# Altium schematic sheet [08] - FPGA - DDR3.SchDoc
size A2; DocumentNumber: 8; SheetNumber: 8; SheetTotal: 15
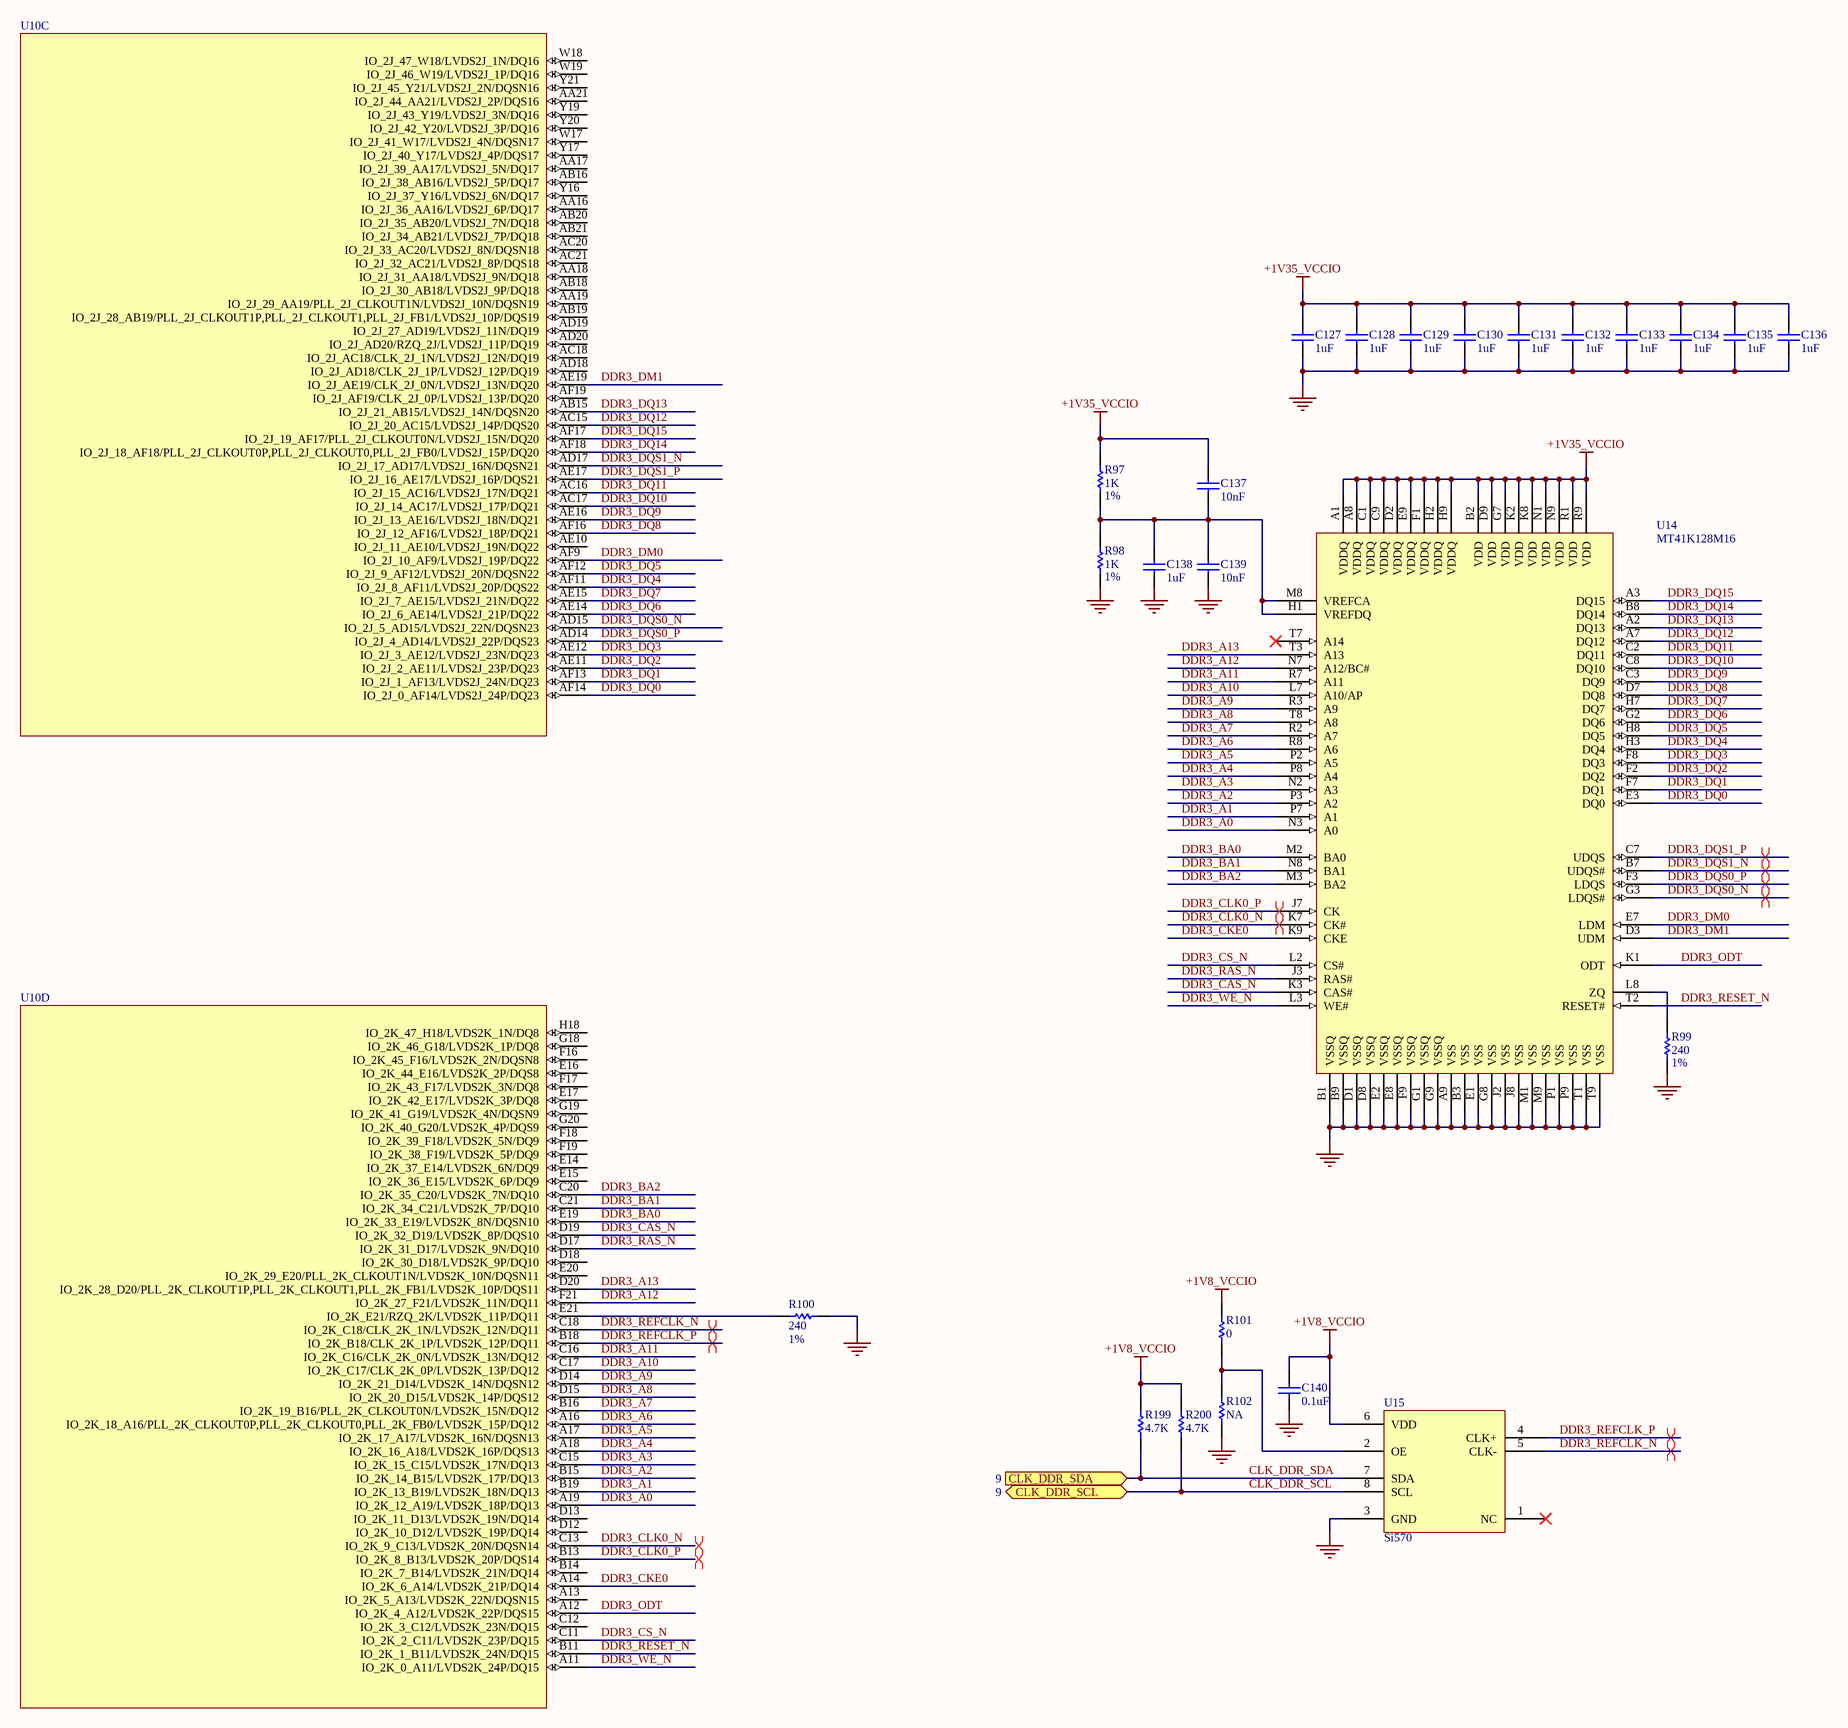
[diagram p0: [08] - FPGA - DDR3.SchDoc]

## Parts
C127  1uF  [0402_C]
C128  1uF  [0402_C]
C129  1uF  [0402_C]
C130  1uF  [0402_C]
C131  1uF  [0402_C]
C132  1uF  [0402_C]
C133  1uF  [0402_C]
C134  1uF  [0402_C]
C135  1uF  [0402_C]
C136  1uF  [0402_C]
C137  10nF  [0402_C]
C138  1uF  [0805_C]
C139  10nF  [0402_C]
C140  0.1uF  [0402_C]
R97  1K  Tolerance: 1%  [0402_R]
R98  1K  Tolerance: 1%  [0402_R]
R99  240  Tolerance: 1%  [0402_R]
R100  240  Tolerance: 1%  [0402_R]
R101  0  [0402_R]
R102  NA  [0402_R]
R199  4.7K  [0402_R]
R200  4.7K  [0402_R]
U10  10AX016 F27  [FBGA672]  (value not drawn)  (parts C,D of 12)
U14  MT41K128M16  [FBGA96]
U15  Si570

## Ports
CLK_DDR_SCL (bidir, see 9), CLK_DDR_SDA (in, see 9)

## Nets
+1V8_VCCIO: C140.1 R101.2 R199.2 R200.2 U15.6(VDD)
+1V35_VCCIO: C127.2 C128.2 C129.2 C130.2 C131.2 C132.2 C133.2 C134.2 C135.2 C136.2 C137.2 R97.2 U14.A1(VDDQ) U14.A8(VDDQ) U14.B2(VDD) U14.C1(VDDQ) U14.C9(VDDQ) U14.D2(VDDQ) U14.D9(VDD) U14.E9(VDDQ) U14.F1(VDDQ) U14.G7(VDD) U14.H2(VDDQ) U14.H9(VDDQ) U14.K2(VDD) U14.K8(VDD) U14.N1(VDD) U14.N9(VDD) U14.R1(VDD) U14.R9(VDD)
GND: C127.1 C128.1 C129.1 C130.1 C131.1 C132.1 C133.1 C134.1 C135.1 C136.1 C138.1 C139.1 C140.2 R98.1 R99.1 R100.1 R102.1 U14.A9(VSS) U14.B1(VSSQ) U14.B3(VSS) U14.B9(VSSQ) U14.D1(VSSQ) U14.D8(VSSQ) U14.E1(VSS) U14.E2(VSSQ) U14.E8(VSSQ) U14.F9(VSSQ) U14.G1(VSSQ) U14.G8(VSS) U14.G9(VSSQ) U14.J2(VSS) U14.J8(VSS) U14.M1(VSS) U14.M9(VSS) U14.P1(VSS) U14.P9(VSS) U14.T1(VSS) U14.T9(VSS) U15.3(GND)
CLK_DDR_SCL: R200.1 U15.8(SCL) ; port CLK_DDR_SCL
CLK_DDR_SDA: R199.1 U15.7(SDA) ; port CLK_DDR_SDA
DDR3_A0: U10.A19(IO_2K_12_A19/LVDS2K_18P/DQ13) U14.N3(A0)
DDR3_A1: U10.B19(IO_2K_13_B19/LVDS2K_18N/DQ13) U14.P7(A1)
DDR3_A2: U10.B15(IO_2K_14_B15/LVDS2K_17P/DQ13) U14.P3(A2)
DDR3_A3: U10.C15(IO_2K_15_C15/LVDS2K_17N/DQ13) U14.N2(A3)
DDR3_A4: U10.A18(IO_2K_16_A18/LVDS2K_16P/DQS13) U14.P8(A4)
DDR3_A5: U10.A17(IO_2K_17_A17/LVDS2K_16N/DQSN13) U14.P2(A5)
DDR3_A6: U10.A16(IO_2K_18_A16/PLL_2K_CLKOUT0P,PLL_2K_CLKOUT0,PLL_2K_FB0/LVDS2K_15P/DQ12) U14.R8(A6)
DDR3_A7: U10.B16(IO_2K_19_B16/PLL_2K_CLKOUT0N/LVDS2K_15N/DQ12) U14.R2(A7)
DDR3_A8: U10.D15(IO_2K_20_D15/LVDS2K_14P/DQS12) U14.T8(A8)
DDR3_A9: U10.D14(IO_2K_21_D14/LVDS2K_14N/DQSN12) U14.R3(A9)
DDR3_A10: U10.C17(IO_2K_C17/CLK_2K_0P/LVDS2K_13P/DQ12) U14.L7(A10/AP)
DDR3_A11: U10.C16(IO_2K_C16/CLK_2K_0N/LVDS2K_13N/DQ12) U14.R7(A11)
DDR3_A12: U10.F21(IO_2K_27_F21/LVDS2K_11N/DQ11) U14.N7(A12/BC#)
DDR3_A13: U10.D20(IO_2K_28_D20/PLL_2K_CLKOUT1P,PLL_2K_CLKOUT1,PLL_2K_FB1/LVDS2K_10P/DQS11) U14.T3(A13)
DDR3_BA0: U10.E19(IO_2K_33_E19/LVDS2K_8N/DQSN10) U14.M2(BA0)
DDR3_BA1: U10.C21(IO_2K_34_C21/LVDS2K_7P/DQ10) U14.N8(BA1)
DDR3_BA2: U10.C20(IO_2K_35_C20/LVDS2K_7N/DQ10) U14.M3(BA2)
DDR3_CAS_N: U10.D19(IO_2K_32_D19/LVDS2K_8P/DQS10) U14.K3(CAS#)
DDR3_CKE0: U10.A14(IO_2K_6_A14/LVDS2K_21P/DQ14) U14.K9(CKE)
DDR3_CLK0_N: U10.C13(IO_2K_9_C13/LVDS2K_20N/DQSN14) U14.K7(CK#)
DDR3_CLK0_P: U10.B13(IO_2K_8_B13/LVDS2K_20P/DQS14) U14.J7(CK)
DDR3_CS_N: U10.C11(IO_2K_2_C11/LVDS2K_23P/DQ15) U14.L2(CS#)
DDR3_DM0: U10.AF9(IO_2J_10_AF9/LVDS2J_19P/DQ22) U14.E7(LDM)
DDR3_DM1: U10.AE19(IO_2J_AE19/CLK_2J_0N/LVDS2J_13N/DQ20) U14.D3(UDM)
DDR3_DQ0: U10.AF14(IO_2J_0_AF14/LVDS2J_24P/DQ23) U14.E3(DQ0)
DDR3_DQ1: U10.AF13(IO_2J_1_AF13/LVDS2J_24N/DQ23) U14.F7(DQ1)
DDR3_DQ2: U10.AE11(IO_2J_2_AE11/LVDS2J_23P/DQ23) U14.F2(DQ2)
DDR3_DQ3: U10.AE12(IO_2J_3_AE12/LVDS2J_23N/DQ23) U14.F8(DQ3)
DDR3_DQ4: U10.AF11(IO_2J_8_AF11/LVDS2J_20P/DQS22) U14.H3(DQ4)
DDR3_DQ5: U10.AF12(IO_2J_9_AF12/LVDS2J_20N/DQSN22) U14.H8(DQ5)
DDR3_DQ6: U10.AE14(IO_2J_6_AE14/LVDS2J_21P/DQ22) U14.G2(DQ6)
DDR3_DQ7: U10.AE15(IO_2J_7_AE15/LVDS2J_21N/DQ22) U14.H7(DQ7)
DDR3_DQ8: U10.AF16(IO_2J_12_AF16/LVDS2J_18P/DQ21) U14.D7(DQ8)
DDR3_DQ9: U10.AE16(IO_2J_13_AE16/LVDS2J_18N/DQ21) U14.C3(DQ9)
DDR3_DQ10: U10.AC17(IO_2J_14_AC17/LVDS2J_17P/DQ21) U14.C8(DQ10)
DDR3_DQ11: U10.AC16(IO_2J_15_AC16/LVDS2J_17N/DQ21) U14.C2(DQ11)
DDR3_DQ12: U10.AC15(IO_2J_20_AC15/LVDS2J_14P/DQS20) U14.A7(DQ12)
DDR3_DQ13: U10.AB15(IO_2J_21_AB15/LVDS2J_14N/DQSN20) U14.A2(DQ13)
DDR3_DQ14: U10.AF18(IO_2J_18_AF18/PLL_2J_CLKOUT0P,PLL_2J_CLKOUT0,PLL_2J_FB0/LVDS2J_15P/DQ20) U14.B8(DQ14)
DDR3_DQ15: U10.AF17(IO_2J_19_AF17/PLL_2J_CLKOUT0N/LVDS2J_15N/DQ20) U14.A3(DQ15)
DDR3_DQS0_N: U10.AD15(IO_2J_5_AD15/LVDS2J_22N/DQSN23) U14.G3(LDQS#)
DDR3_DQS0_P: U10.AD14(IO_2J_4_AD14/LVDS2J_22P/DQS23) U14.F3(LDQS)
DDR3_DQS1_N: U10.AD17(IO_2J_17_AD17/LVDS2J_16N/DQSN21) U14.B7(UDQS#)
DDR3_DQS1_P: U10.AE17(IO_2J_16_AE17/LVDS2J_16P/DQS21) U14.C7(UDQS)
DDR3_ODT: U10.A12(IO_2K_4_A12/LVDS2K_22P/DQS15) U14.K1(ODT)
DDR3_RAS_N: U10.D17(IO_2K_31_D17/LVDS2K_9N/DQ10) U14.J3(RAS#)
DDR3_REFCLK_N: U10.C18(IO_2K_C18/CLK_2K_1N/LVDS2K_12N/DQ11) U15.5(CLK-)
DDR3_REFCLK_P: U10.B18(IO_2K_B18/CLK_2K_1P/LVDS2K_12P/DQ11) U15.4(CLK+)
DDR3_RESET_N: U10.B11(IO_2K_1_B11/LVDS2K_24N/DQ15) U14.T2(RESET#)
DDR3_WE_N: U10.A11(IO_2K_0_A11/LVDS2K_24P/DQ15) U14.L3(WE#)
NetC137_1: C137.1 C138.2 C139.2 R97.1 R98.2 U14.H1(VREFDQ) U14.M8(VREFCA)
NetR99_2: R99.2 U14.L8(ZQ)
NetR100_2: R100.2 U10.E21(IO_2K_E21/RZQ_2K/LVDS2K_11P/DQ11)
NetR101_1: R101.1 R102.2 U15.2(OE)

Not connected (* = marked no-connect by the designer): U10 A13(IO_2K_5_A13/LVDS2K_22N/DQSN15) AA16(IO_2J_36_AA16/LVDS2J_6P/DQ17) AA17(IO_2J_39_AA17/LVDS2J_5N/DQ17) AA18(IO_2J_31_AA18/LVDS2J_9N/DQ18) AA19(IO_2J_29_AA19/PLL_2J_CLKOUT1N/LVDS2J_10N/DQSN19) AA21(IO_2J_44_AA21/LVDS2J_2P/DQS16) AB16(IO_2J_38_AB16/LVDS2J_5P/DQ17) AB18(IO_2J_30_AB18/LVDS2J_9P/DQ18) AB19(IO_2J_28_AB19/PLL_2J_CLKOUT1P,PLL_2J_CLKOUT1,PLL_2J_FB1/LVDS2J_10P/DQS19) AB20(IO_2J_35_AB20/LVDS2J_7N/DQ18) AB21(IO_2J_34_AB21/LVDS2J_7P/DQ18) AC18(IO_2J_AC18/CLK_2J_1N/LVDS2J_12N/DQ19) AC20(IO_2J_33_AC20/LVDS2J_8N/DQSN18) AC21(IO_2J_32_AC21/LVDS2J_8P/DQS18) AD18(IO_2J_AD18/CLK_2J_1P/LVDS2J_12P/DQ19) AD19(IO_2J_27_AD19/LVDS2J_11N/DQ19) AD20(IO_2J_AD20/RZQ_2J/LVDS2J_11P/DQ19) AE10(IO_2J_11_AE10/LVDS2J_19N/DQ22) AF19(IO_2J_AF19/CLK_2J_0P/LVDS2J_13P/DQ20) B14(IO_2K_7_B14/LVDS2K_21N/DQ14) C12(IO_2K_3_C12/LVDS2K_23N/DQ15) D12(IO_2K_10_D12/LVDS2K_19P/DQ14) D13(IO_2K_11_D13/LVDS2K_19N/DQ14) D18(IO_2K_30_D18/LVDS2K_9P/DQ10) E14(IO_2K_37_E14/LVDS2K_6N/DQ9) E15(IO_2K_36_E15/LVDS2K_6P/DQ9) E16(IO_2K_44_E16/LVDS2K_2P/DQS8) E17(IO_2K_42_E17/LVDS2K_3P/DQ8) E20(IO_2K_29_E20/PLL_2K_CLKOUT1N/LVDS2K_10N/DQSN11) F16(IO_2K_45_F16/LVDS2K_2N/DQSN8) F17(IO_2K_43_F17/LVDS2K_3N/DQ8) F18(IO_2K_39_F18/LVDS2K_5N/DQ9) F19(IO_2K_38_F19/LVDS2K_5P/DQ9) G18(IO_2K_46_G18/LVDS2K_1P/DQ8) G19(IO_2K_41_G19/LVDS2K_4N/DQSN9) G20(IO_2K_40_G20/LVDS2K_4P/DQS9) H18(IO_2K_47_H18/LVDS2K_1N/DQ8) W17(IO_2J_41_W17/LVDS2J_4N/DQSN17) W18(IO_2J_47_W18/LVDS2J_1N/DQ16) W19(IO_2J_46_W19/LVDS2J_1P/DQ16) Y16(IO_2J_37_Y16/LVDS2J_6N/DQ17) Y17(IO_2J_40_Y17/LVDS2J_4P/DQS17) Y19(IO_2J_43_Y19/LVDS2J_3N/DQ16) Y20(IO_2J_42_Y20/LVDS2J_3P/DQ16) Y21(IO_2J_45_Y21/LVDS2J_2N/DQSN16); U14 T7(A14)*; U15 1(NC)*

## Layout directives
differential pair; differential pair class DIFF100: DDR3_CLK0_N, DDR3_CLK0_P, DDR3_DQS0_N, DDR3_DQS0_P, DDR3_DQS1_N, DDR3_DQS1_P
differential pair: DDR3_REFCLK_N, DDR3_REFCLK_P

## Library data of the parts
C127-C136 = Cap SMD: Non-Pol SMD Capacitor; Manufacturer Part Num: GRM155R70J105KA12; RATED_VOLTAGE: 6.3V; Dielectric: X7R; Value: 1uF
C137-C140 = Cap SMD: Non-Pol SMD Capacitor; RATED_VOLTAGE: 16V; Manufacturer Part Num: *; Dielectric: *
  C137 C139: Value: 10nF
  C138: Value: 1uF
  C140: Value: 0.1uF
R97-R100 = Res SMD: SMD Resistor; Manufacturer Part Num: *
  R97 R98: Value: 1K
  R99 R100: Value: 240
R101 R102 R199 R200 = Res SMD: SMD Resistor; Tolerance: 5%; Manufacturer Part Num: *
  R101: Value: 0
  R102: Value: NA
  R199 R200: Value: 4.7K
U10 = 10AX016: Value: 10AX016 F27; Manufacturer Part Num: *
U14 = MT41K128M16JT: 2Gb: x16 DDR3 SDRAM; Manufacturer Part Num: MT41K128M16JT-125; Value: MT41K128M16
U15 = Si570: 10 MHZ TO 1.4 GHZ I2C PROGRAMMABLE XO/VCXO; Value: Si570; Manufacturer Part Num: *